# Altium schematic sheet Power.SchDoc: Power Supplies
size Letter; Date: 2017-02-19; Revision: A; SheetNumber: 2; SheetTotal: 6; ProjectTitle: CANwheel
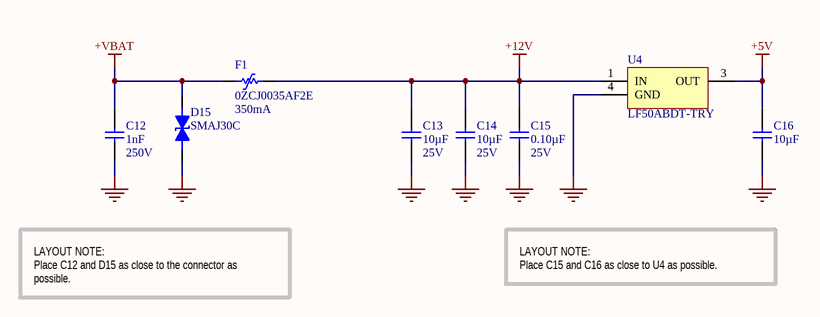
[diagram p0: Power.SchDoc]

## Parts
C12  value 1nF  Voltage: 250V  [CAP-0805-M]  (hidden comment: CAP 1nF ±10% 250V 0805 X7R)
C13  value 10µF  Voltage: 25V  [CAP-1206-M]  (hidden comment: CAP 10µF ±10% 25V 1206 X7R)
C14  value 10µF  Voltage: 25V  [CAP-1206-M]  (hidden comment: CAP 10µF ±10% 25V 1206 X7R)
C15  value 0.10µF  Voltage: 25V  [CAP-0402-M]  (hidden comment: CAP 0.10µF ±10% 25V 0402 X7R)
C16  value 10µF  [CAP-0805-M]  (hidden comment: CAP 10µF ±10% 6.3V 0805 X7R)
D15  SMAJ30C  [SON127P500X135-2N]
F1  0ZCJ0035AF2E  value 350mA  [0ZCJ-1206-0.9]
U4  LF50ABDT-TRY  [DPAK228P972X240-3N]

## Nets
+5V: C16.1 U4.3(OUT)
+12V: C13.2 C14.2 C15.2 F1.2 U4.1(IN)
+VBAT: C12.1 D15.1 F1.1
GND: C12.2 C13.1 C14.1 C15.1 C16.2 D15.2 U4.4(GND)

## Notes on the sheet
- LAYOUT NOTE:
  Place C12 and D15 as close to the connector as possible.
- LAYOUT NOTE:
  Place C15 and C16 as close to U4 as possible.
- Date:
- Revision:
- Sheet:
- /

## Library data of the parts
C12 = CC0805KRX7RYBB102: Manufacturer: Yageo; Manufacturer Series: CC; Part Number: CC0805KRX7RYBB102; Component Type: Standard; Tolerance: ±10%; Package: 0805; Temperature Coefficient: X7R; Temperature Range: -55°C ~ 125°C; Supplier 1: Digi-Key; Supplier Part Number 1: 311-1470-1-ND
C13 C14 = CC1206KKX7R8BB106: Manufacturer: Yageo; Manufacturer Series: CC; Part Number: CC1206KKX7R8BB106; Component Type: Standard; Tolerance: ±10%; Package: 1206; Temperature Coefficient: X7R; Temperature Range: -55°C ~ 125°C; Supplier 1: Digi-Key; Supplier Part Number 1: 311-1959-1-ND
C15 = CC0402KRX7R8BB104: Manufacturer: Yageo; Manufacturer Series: CC; Part Number: CC0402KRX7R8BB104; Component Type: Standard; Tolerance: ±10%; Package: 0402; Temperature Coefficient: X7R; Temperature Range: -55°C ~ 125°C; Supplier 1: Digi-Key; Supplier Part Number 1: 311-2077-1-ND
C16 = CC0805KKX7R5BB106: Manufacturer: Yageo; Manufacturer Series: CC; Part Number: CC0805KKX7R5BB106; Component Type: Standard; Tolerance: ±10%; Voltage: 6.3V; Package: 0805; Temperature Coefficient: X7R; Temperature Range: -55°C ~ 125°C; Supplier 1: Digi-Key; Supplier Part Number 1: 311-1877-1-ND
U4 = LF50ABDT-TRY: Supplier 1: Digi-Key; Supplier Part Number 1: 497-10199-1-ND